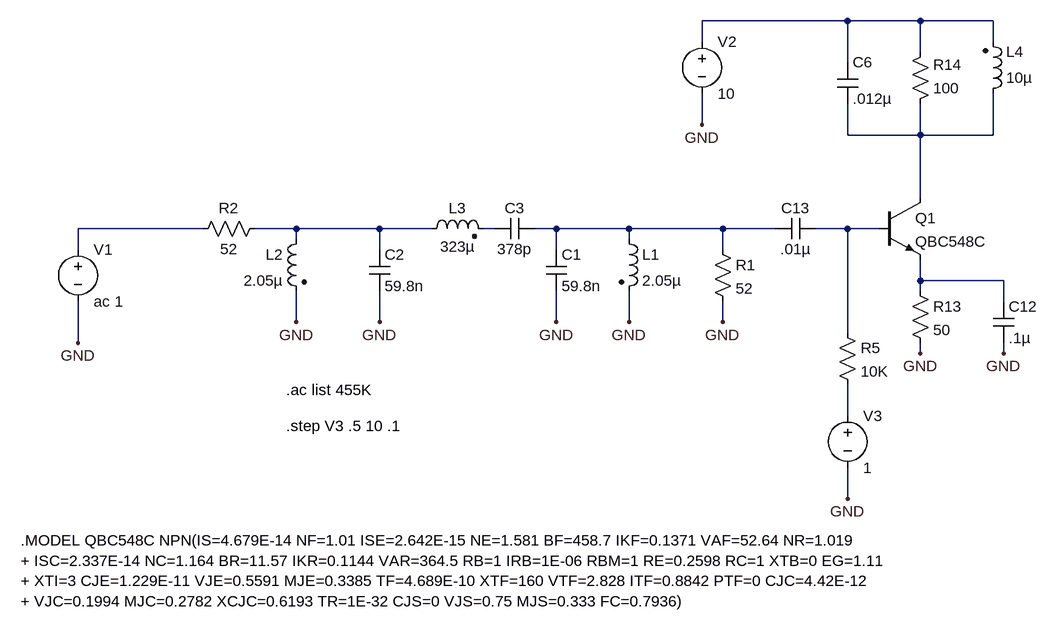
[diagram p0: schematic IFxister.asc]
IFxister.asc, the LTspice schematic file:
Version 4
SHEET 1 3356 1588
WIRE 2864 1008 2864 1040
WIRE 2864 1120 2864 1152
WIRE 2064 1008 1872 1008
WIRE 2864 1008 2944 1008
WIRE 2208 1152 2208 1104
WIRE 2208 1024 2208 1008
WIRE 2208 1008 2336 1008
WIRE 2496 1008 2512 1008
WIRE 2576 1008 2608 1008
WIRE 2720 1008 2720 1024
WIRE 2720 1104 2720 1152
WIRE 2336 1152 2336 1104
WIRE 2336 1040 2336 1008
WIRE 2336 1008 2416 1008
WIRE 2608 1008 2608 1040
WIRE 2608 1104 2608 1152
WIRE 2608 1008 2720 1008
WIRE 2720 1008 2864 1008
WIRE 2208 1008 2144 1008
WIRE 3168 864 3168 960
WIRE 3168 1056 3168 1088
WIRE 3168 1184 3168 1200
WIRE 3168 1088 3296 1088
WIRE 3168 1088 3168 1104
WIRE 3296 1088 3296 1120
WIRE 3296 1184 3296 1200
WIRE 3008 1008 3056 1008
WIRE 3056 1008 3056 1168
WIRE 3056 1248 3056 1296
WIRE 3056 1008 3104 1008
WIRE 3280 864 3280 800
WIRE 3056 864 3056 816
WIRE 3280 720 3280 688
WIRE 3056 752 3056 688
WIRE 3168 688 3168 736
WIRE 3168 816 3168 864
WIRE 3280 864 3168 864
WIRE 3168 864 3056 864
WIRE 2832 848 2832 800
WIRE 2832 720 2832 688
WIRE 3280 688 3168 688
WIRE 3056 688 2832 688
WIRE 3168 688 3056 688
WIRE 1872 1008 1872 1040
WIRE 1872 1120 1872 1184
WIRE 3056 1424 3056 1376
FLAG 2864 1152 GND
FLAG 2720 1152 GND
FLAG 2608 1152 GND
FLAG 2336 1152 GND
FLAG 2208 1152 GND
FLAG 3168 1200 GND
FLAG 3296 1200 GND
FLAG 2832 848 GND
FLAG 1872 1184 GND
FLAG 3056 1424 GND
SYMBOL RES 2848 1024 R0
SYMATTR InstName R1
SYMATTR Value 52
SYMBOL res 2160 992 R90
WINDOW 0 0 56 VBottom 0
WINDOW 3 32 56 VTop 0
SYMATTR InstName R2
SYMATTR Value 52
SYMBOL ind2 2704 1008 R0
SYMATTR InstName L1
SYMATTR Value 2.05µ
SYMBOL cap 2592 1040 R0
SYMATTR InstName C1
SYMATTR Value 59.8n
SYMBOL cap 2320 1040 R0
SYMATTR InstName C2
SYMATTR Value 59.8n
SYMBOL ind2 2224 1008 M0
SYMATTR InstName L2
SYMATTR Value 2.05µ
SYMBOL ind2 2400 1024 R270
WINDOW 0 32 56 VTop 0
WINDOW 3 4 56 VBottom 0
SYMATTR InstName L3
SYMATTR Value 323µ
SYMBOL cap 2576 992 R90
WINDOW 0 0 32 VBottom 0
WINDOW 3 32 32 VTop 0
SYMATTR InstName C3
SYMATTR Value 378p
SYMBOL npn 3104 960 R0
SYMATTR InstName Q1
SYMATTR Value QBC548C
SYMBOL res 3152 1088 R0
SYMATTR InstName R13
SYMATTR Value 50
SYMBOL cap 3280 1120 R0
SYMATTR InstName C12
SYMATTR Value .1µ
SYMBOL cap 3008 992 R90
WINDOW 0 0 32 VBottom 0
WINDOW 3 32 32 VTop 0
SYMATTR InstName C13
SYMATTR Value .01µ
SYMBOL res 3040 1152 R0
SYMATTR InstName R5
SYMATTR Value 10K
SYMBOL ind2 3264 816 M180
WINDOW 0 36 80 Left 0
WINDOW 3 36 40 Left 0
SYMATTR InstName L4
SYMATTR Value 10µ
SYMBOL cap 3040 816 M180
WINDOW 0 24 64 Left 0
WINDOW 3 24 8 Left 0
SYMATTR InstName C6
SYMATTR Value .012µ
SYMBOL res 3152 832 M180
WINDOW 0 36 76 Left 0
WINDOW 3 36 40 Left 0
SYMATTR InstName R14
SYMATTR Value 100
SYMBOL voltage 2832 704 R0
SYMATTR InstName V2
SYMATTR Value 10
SYMBOL voltage 1872 1024 R0
SYMATTR InstName V1
SYMATTR Value ac 1
SYMBOL voltage 3056 1280 R0
SYMATTR InstName V3
SYMATTR Value 1
text 1784 1488 Left 0 !.MODEL QBC548C NPN(IS=4.679E-14 NF=1.01 ISE=2.642E-15 NE=1.581 BF=458.7 IKF=0.1371 VAF=52.64 NR=1.019\n+ ISC=2.337E-14 NC=1.164 BR=11.57 IKR=0.1144 VAR=364.5 RB=1 IRB=1E-06 RBM=1 RE=0.2598 RC=1 XTB=0 EG=1.11\n+ XTI=3 CJE=1.229E-11 VJE=0.5591 MJE=0.3385 TF=4.689E-10 XTF=160 VTF=2.828 ITF=0.8842 PTF=0 CJC=4.42E-12\n+ VJC=0.1994 MJC=0.2782 XCJC=0.6193 TR=1E-32 CJS=0 VJS=0.75 MJS=0.333 FC=0.7936)
text 2192 1256 Left 0 !.ac list 455K
text 2192 1312 Left 0 !.step V3 .5 10 .1

The netlist it stands for:
* IFxister.asc
R1 N001 GND 52
R2 N003 N002 52
L1 N001 GND 2.05µ
C1 N001 GND 59.8n
C2 N003 GND 59.8n
L2 N003 GND 2.05µ
L3 N003 N004 323µ
C3 N001 N004 378p
Q1 N005 N007 N006 0 QBC548C
R13 N006 GND 50
C12 N006 GND .1µ
C13 N007 N001 .01µ
R5 N007 N008 10K
L4 N005 N009 10µ
C6 N005 N009 .012µ
R14 N005 N009 100
V2 N009 GND 10
V1 N002 GND ac 1
V3 N008 GND 1
.model NPN NPN
.model PNP PNP
.lib standard.bjt
.MODEL QBC548C NPN(IS=4.679E-14 NF=1.01 ISE=2.642E-15 NE=1.581 BF=458.7 IKF=0.1371 VAF=52.64 NR=1.019
+ ISC=2.337E-14 NC=1.164 BR=11.57 IKR=0.1144 VAR=364.5 RB=1 IRB=1E-06 RBM=1 RE=0.2598 RC=1 XTB=0 EG=1.11
+ XTI=3 CJE=1.229E-11 VJE=0.5591 MJE=0.3385 TF=4.689E-10 XTF=160 VTF=2.828 ITF=0.8842 PTF=0 CJC=4.42E-12
+ VJC=0.1994 MJC=0.2782 XCJC=0.6193 TR=1E-32 CJS=0 VJS=0.75 MJS=0.333 FC=0.7936)
.ac list 455K
.step V3 .5 10 .1
.backanno
.end